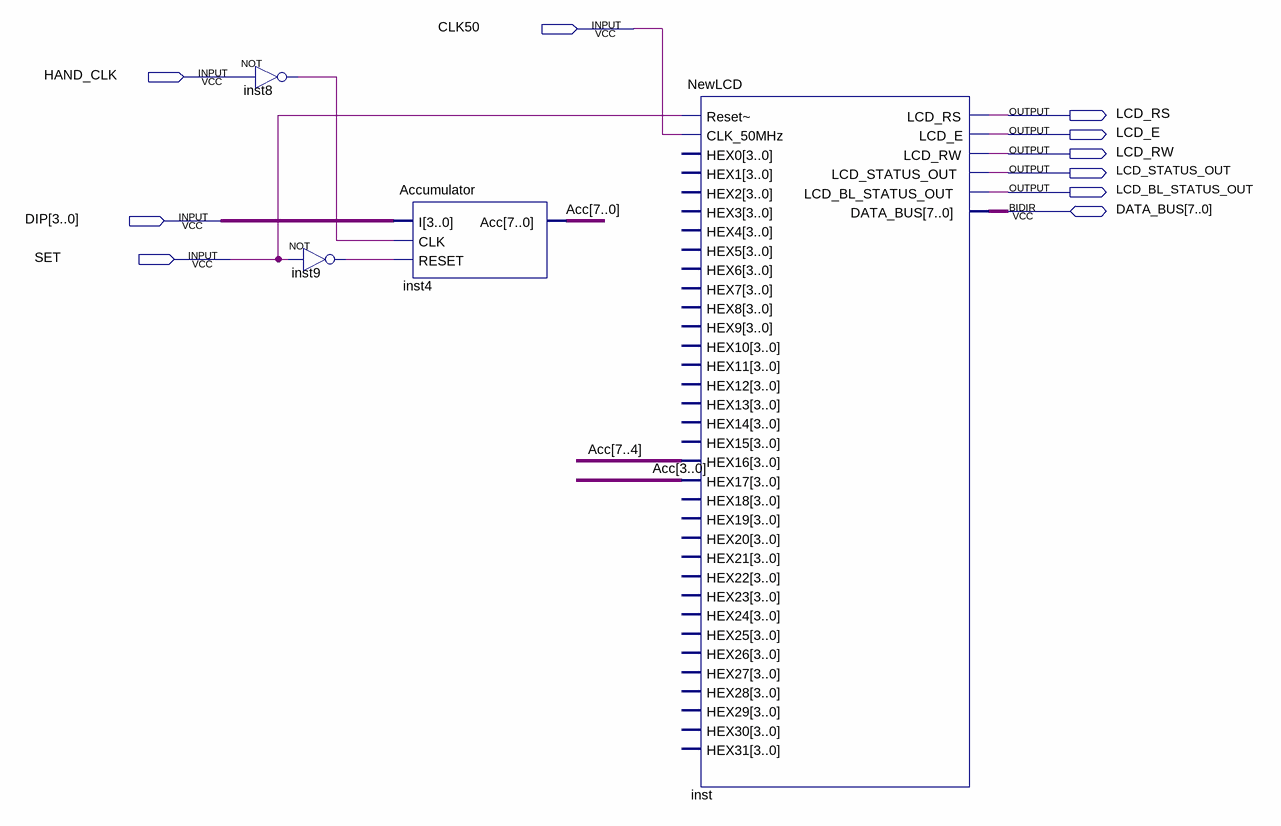
[diagram p0: schematic sheet]
// Quartus schematic AccBoard.bdf as structural Verilog: 4 symbols, 10 pins
module AccBoard (
  input  CLK50,
  input  HAND_CLK,
  input  [3:0] DIP,
  input  SET,
  inout  [7:0] DATA_BUS,
  output LCD_RS,
  output LCD_E,
  output LCD_RW,
  output LCD_STATUS_OUT,
  output LCD_BL_STATUS_OUT
);

  wire inst8_out, inst9_out;
  wire [7:0] Acc;

  not inst8 (inst8_out, HAND_CLK);
  not inst9 (inst9_out, SET);
  Accumulator inst4 (.I(DIP), .CLK(inst8_out), .RESET(inst9_out), .Acc(Acc));
  NewLCD inst (
    .\Reset~ (SET), .CLK_50MHz(CLK50), .HEX16(Acc[7:4]), .HEX17(Acc[3:0]), .LCD_RS(LCD_RS), .LCD_E(LCD_E),
    .LCD_RW(LCD_RW), .LCD_STATUS_OUT(LCD_STATUS_OUT), .LCD_BL_STATUS_OUT(LCD_BL_STATUS_OUT),
    .DATA_BUS(DATA_BUS));  // open: HEX0, HEX1, HEX2, HEX3, HEX4, HEX5, HEX6, HEX7, HEX8, HEX9, HEX10, HEX11, HEX12, HEX13, HEX14, HEX15, HEX18, HEX19, HEX20, HEX21, HEX22, HEX23, HEX24, HEX25, HEX26, HEX27, HEX28, HEX29, HEX30, HEX31
endmodule
